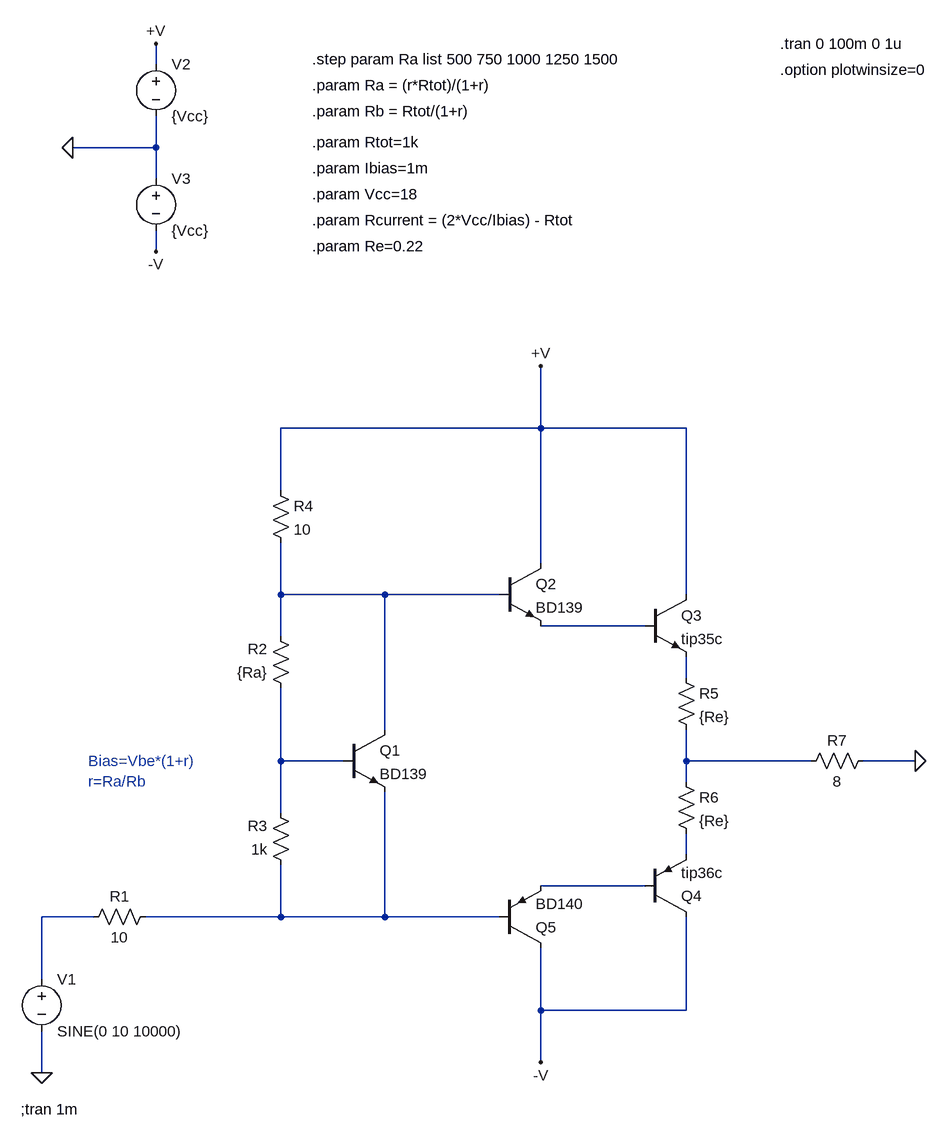
[diagram p0: schematic Bias voltage - simple.asc]
Bias voltage - simple.asc, the LTspice schematic file:
Version 4
SHEET 1 1280 1224
WIRE 64 -400 64 -432
WIRE 64 -272 64 -320
WIRE 64 -272 -64 -272
WIRE 64 -224 64 -272
WIRE 64 -112 64 -144
WIRE 656 160 656 64
WIRE 656 160 256 160
WIRE 880 160 656 160
WIRE 256 256 256 160
WIRE 656 368 656 160
WIRE 256 416 256 336
WIRE 416 416 256 416
WIRE 592 416 416 416
WIRE 880 416 880 160
WIRE 816 464 656 464
WIRE 256 480 256 416
WIRE 880 544 880 512
WIRE 416 624 416 416
WIRE 256 672 256 560
WIRE 352 672 256 672
WIRE 880 672 880 624
WIRE 1072 672 880 672
WIRE 1232 672 1152 672
WIRE 880 704 880 672
WIRE 256 752 256 672
WIRE 880 816 880 784
WIRE 816 864 656 864
WIRE -32 912 -112 912
WIRE 256 912 256 832
WIRE 256 912 48 912
WIRE 416 912 416 720
WIRE 416 912 256 912
WIRE 592 912 416 912
WIRE -112 1008 -112 912
WIRE 656 1056 656 960
WIRE 880 1056 880 912
WIRE 880 1056 656 1056
WIRE 656 1136 656 1056
WIRE -112 1152 -112 1088
FLAG 656 64 +V
FLAG 656 1136 -V
FLAG -112 1152 0
FLAG -64 -272 0
FLAG 64 -432 +V
FLAG 64 -112 -V
FLAG 1232 672 0
SYMBOL voltage -112 992 R0
WINDOW 123 0 0 Left 0
WINDOW 39 0 0 Left 0
SYMATTR InstName V1
SYMATTR Value SINE(0 10 10000)
SYMBOL res 64 896 R90
WINDOW 0 0 56 VBottom 2
WINDOW 3 32 56 VTop 2
SYMATTR InstName R1
SYMATTR Value 10
SYMBOL res 272 576 R180
WINDOW 0 36 76 Left 2
WINDOW 3 36 40 Left 2
SYMATTR InstName R2
SYMATTR Value {Ra}
SYMBOL res 272 848 R180
WINDOW 0 36 76 Left 2
WINDOW 3 36 40 Left 2
SYMATTR InstName R3
SYMATTR Value 1k
SYMBOL npn 352 624 R0
SYMATTR InstName Q1
SYMATTR Value BD139
SYMBOL npn 592 368 R0
SYMATTR InstName Q2
SYMATTR Value BD139
SYMBOL npn 816 416 R0
SYMATTR InstName Q3
SYMATTR Value tip35c
SYMBOL res 240 240 R0
SYMATTR InstName R4
SYMATTR Value 10
SYMBOL pnp 816 912 M180
SYMATTR InstName Q4
SYMATTR Value tip36c
SYMBOL pnp 592 960 M180
SYMATTR InstName Q5
SYMATTR Value BD140
SYMBOL res 864 528 R0
SYMATTR InstName R5
SYMATTR Value {Re}
SYMBOL res 864 688 R0
SYMATTR InstName R6
SYMATTR Value {Re}
SYMBOL voltage 64 -416 R0
WINDOW 123 0 0 Left 0
WINDOW 39 0 0 Left 0
SYMATTR InstName V2
SYMATTR Value {Vcc}
SYMBOL voltage 64 -240 R0
WINDOW 123 0 0 Left 0
WINDOW 39 0 0 Left 0
SYMATTR InstName V3
SYMATTR Value {Vcc}
SYMBOL res 1168 656 R90
WINDOW 0 0 56 VBottom 2
WINDOW 3 32 56 VTop 2
SYMATTR InstName R7
SYMATTR Value 8
TEXT 304 -368 Left 2 !.param Ra = (r*Rtot)/(1+r)
TEXT -40 672 Left 2 ;Bias=Vbe*(1+r)\nr=Ra/Rb
TEXT 304 -408 Left 2 !.step param Ra list 500 750 1000 1250 1500
TEXT 304 -328 Left 2 !.param Rb = Rtot/(1+r)
TEXT 304 -280 Left 2 !.param Rtot=1k
TEXT 304 -240 Left 2 !.param Ibias=1m
TEXT 304 -200 Left 2 !.param Vcc=18
TEXT 304 -160 Left 2 !.param Rcurrent = (2*Vcc/Ibias) - Rtot
TEXT 304 -120 Left 2 !.param Re=0.22
TEXT -144 1208 Left 2 !;tran 1m
TEXT 1024 -432 Left 2 !.tran 0 100m 0 1u
TEXT 1024 -392 Left 2 !.option plotwinsize=0

The netlist it stands for:
* Bias voltage - simple.asc
V1 N008 0 SINE(0 10 10000)
R1 N009 N008 10
R2 N004 N001 {Ra}
R3 N009 N004 1k
Q1 N001 N004 N009 0 BD139
Q2 +V N001 N002 0 BD139
Q3 +V N002 N003 0 tip35c
R4 +V N001 10
Q4 -V N007 N006 0 tip36c
Q5 -V N009 N007 0 BD140
R5 N003 N005 {Re}
R6 N005 N006 {Re}
V2 +V 0 {Vcc}
V3 0 -V {Vcc}
R7 0 N005 8
.model NPN NPN
.model PNP PNP
.lib standard.bjt
.param Ra = (r*Rtot)/(1+r)
* Bias=Vbe*(1+r)
* r=Ra/Rb
.step param Ra list 500 750 1000 1250 1500
.param Rb = Rtot/(1+r)
.param Rtot=1k
.param Ibias=1m
.param Vcc=18
.param Rcurrent = (2*Vcc/Ibias) - Rtot
.param Re=0.22
;tran 1m
.tran 0 100m 0 1u
.option plotwinsize=0
.backanno
.end